# Altium schematic sheet PicoPrint-MOSFETs.SchDoc
size A3; DocumentNumber: 3; SheetNumber: 3; SheetTotal: 5
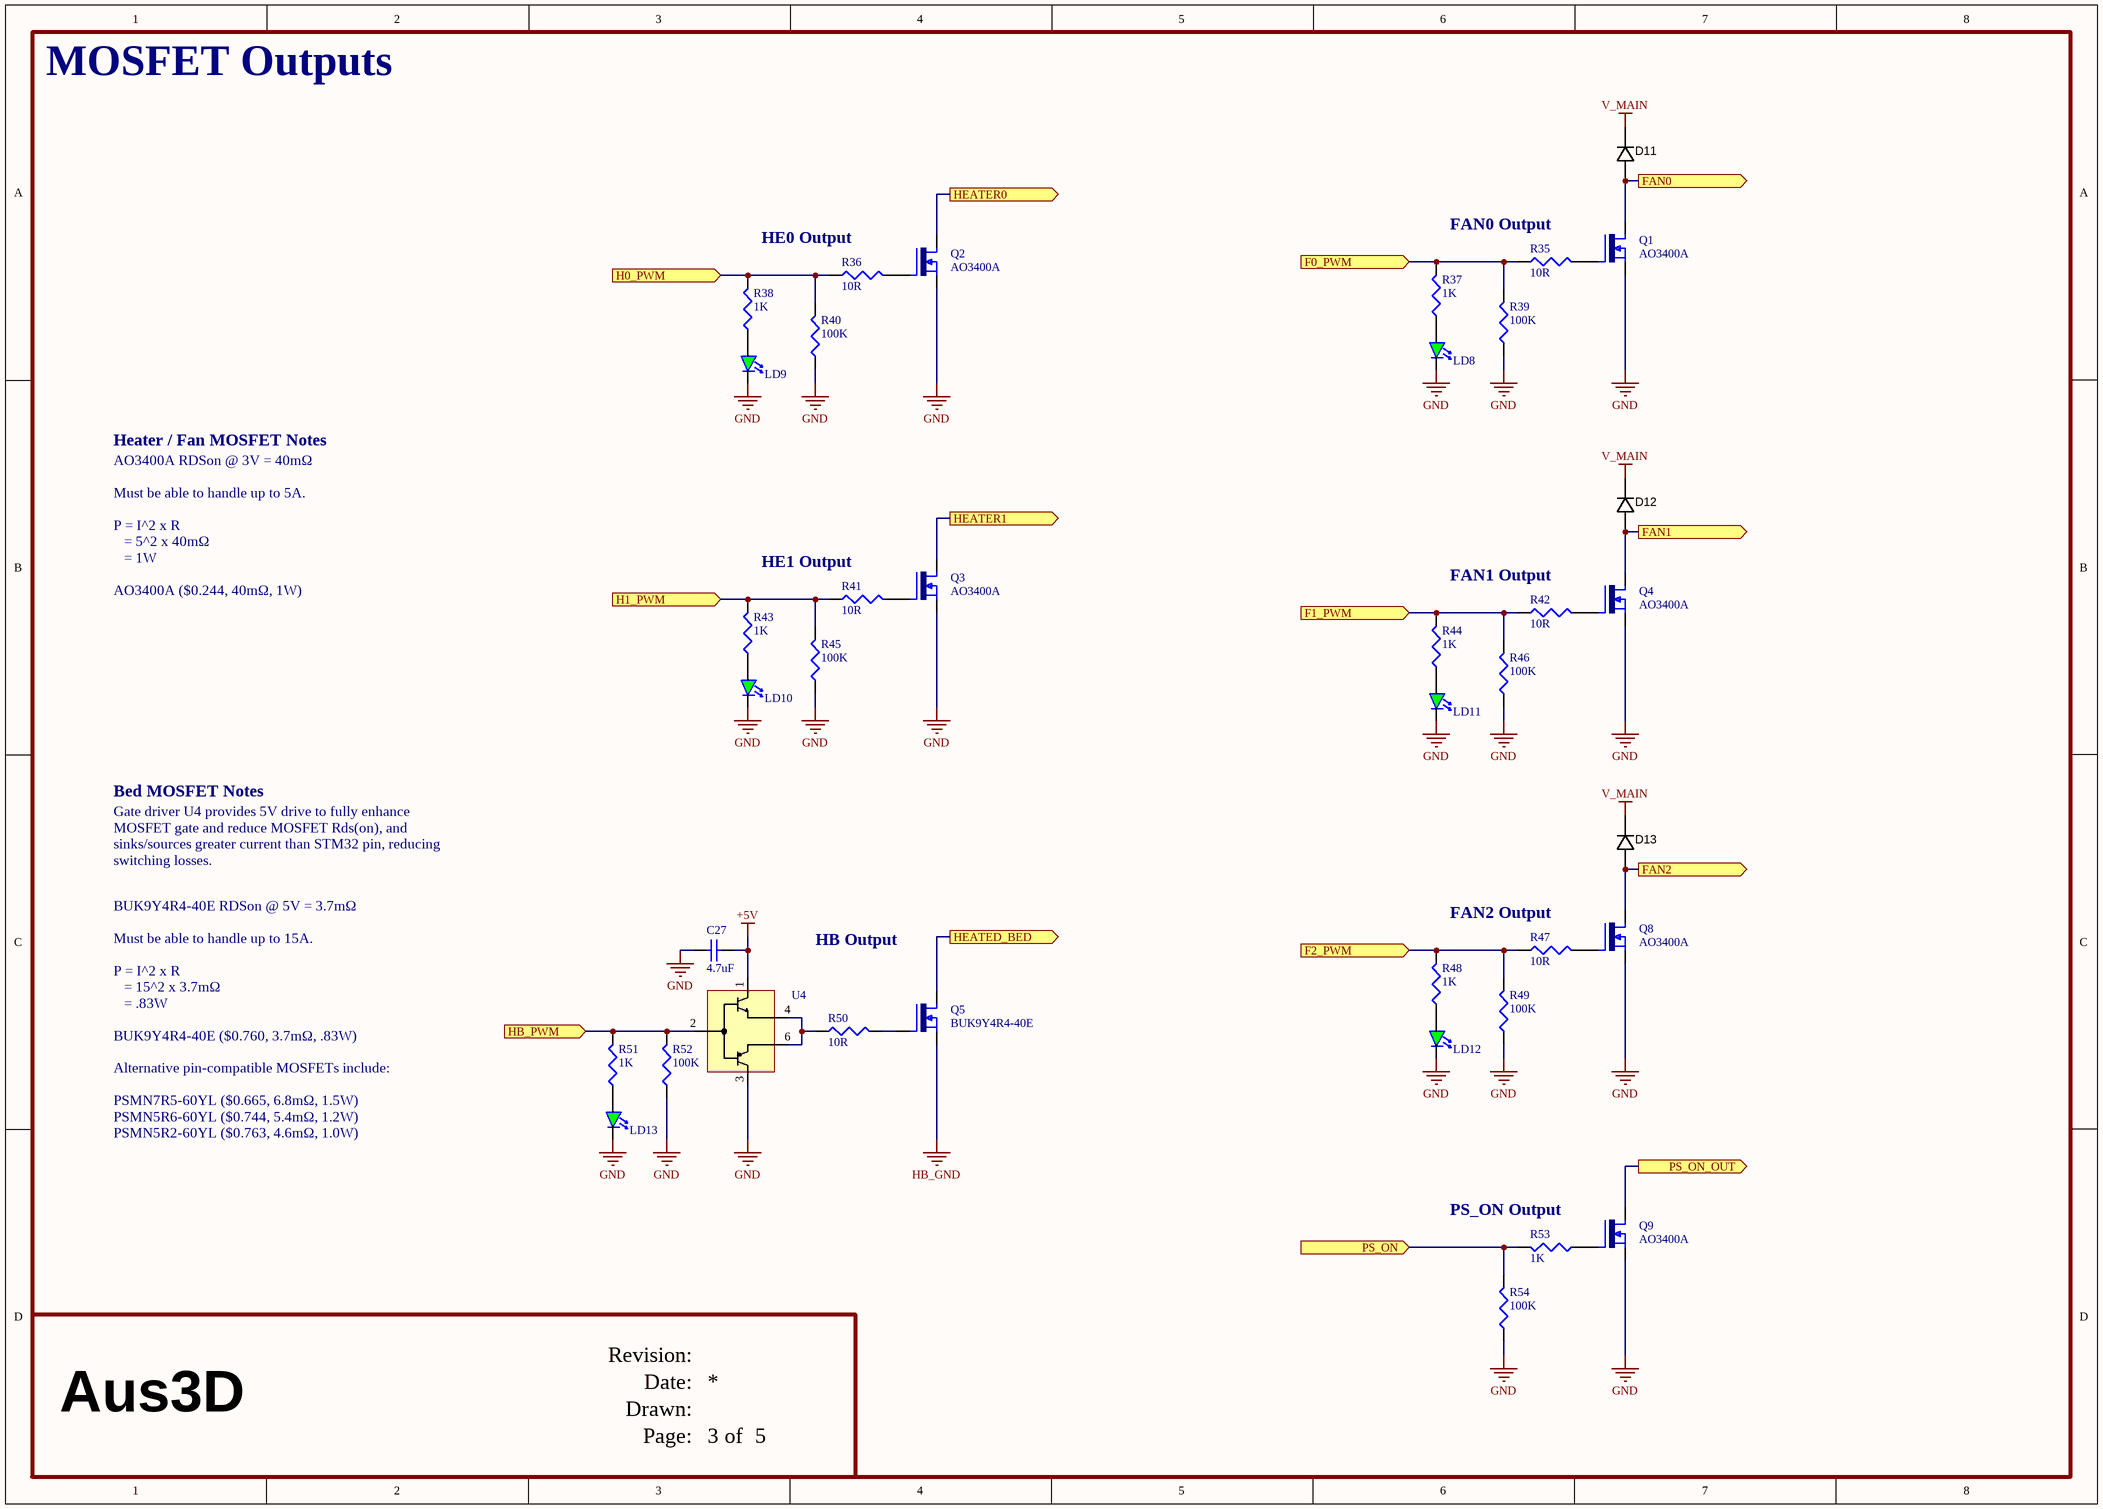
[diagram p0: PicoPrint-MOSFETs.SchDoc]

## Parts
C27  value 4.7uF  [CAP 1005-0402]  (hidden comment: CapC-0402-4.7uF-10V)
D11  General 500mW 75V SOD323  [SOD323]  (value not drawn)
D12  General 500mW 75V SOD323  [SOD323]  (value not drawn)
D13  General 500mW 75V SOD323  [SOD323]  (value not drawn)
LD8  LED-0402  [LED 0402]  (value not drawn)
LD9  LED-0402  [LED 0402]  (value not drawn)
LD10  LED-0402  [LED 0402]  (value not drawn)
LD11  LED-0402  [LED 0402]  (value not drawn)
LD12  LED-0402  [LED 0402]  (value not drawn)
LD13  LED-0402  [LED 0402]  (value not drawn)
Q1  AO3400A  [SOT23-3 New]
Q2  AO3400A  [SOT23-3 New]
Q3  AO3400A  [SOT23-3 New]
Q4  AO3400A  [SOT23-3 New]
Q5  BUK9Y4R4-40E  [LFPACK]
Q8  AO3400A  [SOT23-3 New]
Q9  AO3400A  [SOT23-3 New]
R35  value 10R  [RESC1005X40N]  (hidden comment: Res-0402-10R)
R36  value 10R  [RESC1005X40N]  (hidden comment: Res-0402-10R)
R37  value 1K  [RESC1005X40N]  (hidden comment: Res-0402-1K)
R38  value 1K  [RESC1005X40N]  (hidden comment: Res-0402-1K)
R39  value 100K  [RESC1005X40N]  (hidden comment: Res-0402-100K)
R40  value 100K  [RESC1005X40N]  (hidden comment: Res-0402-100K)
R41  value 10R  [RESC1005X40N]  (hidden comment: Res-0402-10R)
R42  value 10R  [RESC1005X40N]  (hidden comment: Res-0402-10R)
R43  value 1K  [RESC1005X40N]  (hidden comment: Res-0402-1K)
R44  value 1K  [RESC1005X40N]  (hidden comment: Res-0402-1K)
R45  value 100K  [RESC1005X40N]  (hidden comment: Res-0402-100K)
R46  value 100K  [RESC1005X40N]  (hidden comment: Res-0402-100K)
R47  value 10R  [RESC1005X40N]  (hidden comment: Res-0402-10R)
R48  value 1K  [RESC1005X40N]  (hidden comment: Res-0402-1K)
R49  value 100K  [RESC1005X40N]  (hidden comment: Res-0402-100K)
R50  value 10R  [RESC1005X40N]  (hidden comment: Res-0402-10R)
R51  value 1K  [RESC1005X40N]  (hidden comment: Res-0402-1K)
R52  value 100K  [RESC1005X40N]  (hidden comment: Res-0402-100K)
R53  value 1K  [RESC1005X40N]  (hidden comment: Res-0402-1K)
R54  value 100K  [RESC1005X40N]  (hidden comment: Res-0402-100K)
U4  Gate Driver  [SOT363]  (value not drawn)

## Ports
F0_PWM (in), F1_PWM (in), F2_PWM (in), FAN0 (out), FAN1 (out), FAN2 (out), H0_PWM (in), H1_PWM (in), HB_PWM (in), HEATED_BED (out), HEATER0 (out), HEATER1 (out), PS_ON (in), PS_ON_OUT (out)

## Nets
+5V: C27.1 U4.1(VCC)
GND: C27.2 LD8.2(K) LD9.2(K) LD10.2(K) LD11.2(K) LD12.2(K) LD13.2(K) Q1.2(S) Q2.2(S) Q3.2(S) Q4.2(S) Q8.2(S) Q9.2(S) R39.1 R40.1 R45.1 R46.1 R49.1 R52.1 R54.1 U4.3(VEE)
HB_GND: Q5.3(S)
V_MAIN: D11.K D12.K D13.K
F0_PWM: R35.1 R37.2 R39.2 ; port F0_PWM
F1_PWM: R42.1 R44.2 R46.2 ; port F1_PWM
F2_PWM: R47.1 R48.2 R49.2 ; port F2_PWM
FAN0: D11.A Q1.3(D) ; port FAN0
FAN1: D12.A Q4.3(D) ; port FAN1
FAN2: D13.A Q8.3(D) ; port FAN2
H0_PWM: R36.1 R38.2 R40.2 ; port H0_PWM
H1_PWM: R41.1 R43.2 R45.2 ; port H1_PWM
HB_PWM: R51.2 R52.2 U4.2(IN) ; port HB_PWM
HEATED_BED: Q5.2(D) ; port HEATED_BED
HEATER0: Q2.3(D) ; port HEATER0
HEATER1: Q3.3(D) ; port HEATER1
PS_ON: R53.2 R54.2 ; port PS_ON
PS_ON_OUT: Q9.3(D) ; port PS_ON_OUT
NetLD8_1: LD8.1(A) R37.1
NetLD9_1: LD9.1(A) R38.1
NetLD10_1: LD10.1(A) R43.1
NetLD11_1: LD11.1(A) R44.1
NetLD12_1: LD12.1(A) R48.1
NetLD13_1: LD13.1(A) R51.1
NetQ1_1: Q1.1(G) R35.2
NetQ2_1: Q2.1(G) R36.2
NetQ3_1: Q3.1(G) R41.2
NetQ4_1: Q4.1(G) R42.2
NetQ5_1: Q5.1(G) R50.2
NetQ8_1: Q8.1(G) R47.2
NetQ9_1: Q9.1(G) R53.1
NetR50_1: R50.1 U4.4(SOURCE) U4.6(SINK)

## Notes on the sheet
- MOSFET Outputs
- HE0 Output
- FAN0 Output
- Heater / Fan MOSFET Notes
- HE1 Output
- FAN1 Output
- AO3400A RDSon @ 3V = 40mΩ
  Must be able to handle up to 5A.
  P = I^2 x R
  = 5^2 x 40mΩ
  = 1W
  AO3400A ($0.244, 40mΩ, 1W)
- Bed MOSFET Notes
- Gate driver U4 provides 5V drive to fully enhance MOSFET gate and reduce MOSFET Rds(on), and sinks/sources greater current than STM32 pin, reducing switching losses.
- FAN2 Output
- HB Output
- BUK9Y4R4-40E RDSon @ 5V = 3.7mΩ
  Must be able to handle up to 15A.
  P = I^2 x R
  = 15^2 x 3.7mΩ
  = .83W
  BUK9Y4R4-40E ($0.760, 3.7mΩ, .83W)
  Alternative pin-compatible MOSFETs include:
  PSMN7R5-60YL ($0.665, 6.8mΩ, 1.5W)
  PSMN5R6-60YL ($0.744, 5.4mΩ, 1.2W)
  PSMN5R2-60YL ($0.763, 4.6mΩ, 1.0W)
- (near R53) PS_ON Output
- Date:
- Revision:
- Aus3D
- Drawn:
- Page:
- of

## Library data of the parts
C27 = CapC-0402-4.7uF-10V: Capacitor (SMD Ceramic); Voltage: 10V; Note: Approved sub OK; Published: 8-Jun-2000; Revision: July-2002: Re-released for DXP Platform.; Publisher: Altium Limited; Supplier 1: Digi-Key; Supplier Part Number 1: 1276-1482-1-ND
D11-D13 = DIODE_75V_500mW: Diode (SMD); Manufacturer: Micro Commercial Co; Manufacturer Part Number: 1N4148WX-TP; Ratings: 75V; 300mA; 0.5W; Material: Si; Diode Type: Standard; Value: Vf=1V @ 50mA; SCDType: source; Note: Approved sub OK; Package / Case: SOD323; Supplier 1: Digi-Key; Supplier Part Number 1: 1N4148WXTPMSCT-ND
LD8-LD13 = LEDG  0402: LED (SMD); Note: Approved sub OK; Value: Green; Supplier 1: Digi-Key; Supplier Part Number 1: 732-11992-1-ND; Parameter 1: *
Q1-Q4 Q8 Q9 = MOSFET - AO3400A: N-CH MOSFET 30V 5.7A SOT23; Supplier 1: Digi-Key; Supplier Part Number 1: 785-1000-1-ND
Q5 = MOSFET - PSMN1R8-40YLC: N-CH MOSFET 40V 100A LFPAK; Supplier 1: Digi-Key; Supplier Part Number 1: 1727-1502-1-ND
R35 R36 R41 R42 R47 R50 = Res-0402-10R: Resistor; Note: Approved sub OK; Published: 8-Jun-2000; Revision: July-2002: Re-released for DXP Platform.; Publisher: Altium Limited; Supplier 1: Digi-Key; Supplier Part Number 1: 311-10JRCT-ND
R37 R38 R43 R44 R48 R51 R53 = Res-0402-1K: Resistor; Note: Approved sub OK; Published: 8-Jun-2000; Revision: July-2002: Re-released for DXP Platform.; Publisher: Altium Limited; Supplier 1: Digi-Key; Supplier Part Number 1: 311-1.0KJRCT-ND
R39 R40 R45 R46 R49 R52 R54 = Res-0402-100K: Resistor; Note: Approved sub OK; Published: 8-Jun-2000; Revision: July-2002: Re-released for DXP Platform.; Publisher: Altium Limited; Supplier 1: Digi-Key; Supplier Part Number 1: 311-100KJRCT-ND
U4 = MOSFET Driver - 40V 1A Gate Driver ZXGD3009DY: MOSFET Gate Driver IC; Supplier 1: Digi-Key; Supplier Part Number 1: ZXGD3009DYTADICT-ND